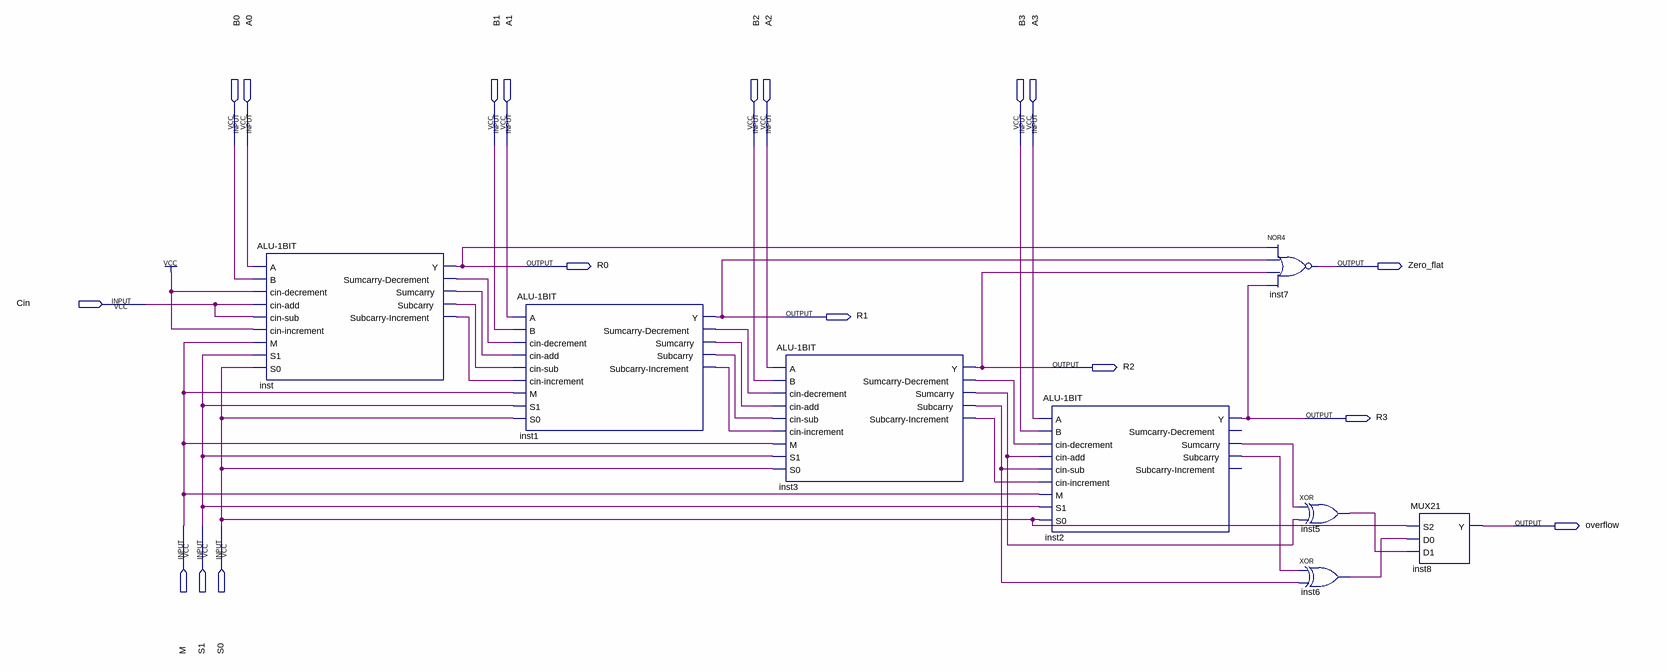
[diagram p0: schematic sheet]
// Quartus schematic ALU-8BIT.bdf as structural Verilog: 8 symbols, 18 pins
module \ALU-8BIT  (
  input  B0,
  input  A0,
  input  B1,
  input  A1,
  input  B2,
  input  A2,
  input  B3,
  input  A3,
  input  Cin,
  input  M,
  input  S1,
  input  S0,
  output R0,
  output Zero_flat,
  output R1,
  output R2,
  output R3,
  output overflow
);

  wire inst1_subcarry, inst1_subcarry_increment, inst1_sumcarry, inst1_sumcarry_decrement, inst2_subcarry,
       inst2_sumcarry, inst3_subcarry, inst3_subcarry_increment, inst3_sumcarry, inst3_sumcarry_decrement,
       inst5_out, inst6_out, inst_subcarry, inst_subcarry_increment, inst_sumcarry, inst_sumcarry_decrement;

  \ALU-1BIT  inst (
    .A(A0), .B(B0), .\cin-decrement (1'b1), .\cin-add (Cin), .\cin-sub (Cin), .\cin-increment (1'b1), .M(M),
    .S1(S1), .S0(S0), .Y(R0), .\Sumcarry-Decrement (inst_sumcarry_decrement), .Sumcarry(inst_sumcarry),
    .Subcarry(inst_subcarry), .\Subcarry-Increment (inst_subcarry_increment));
  \ALU-1BIT  inst1 (
    .A(A1), .B(B1), .\cin-decrement (inst_sumcarry_decrement), .\cin-add (inst_sumcarry),
    .\cin-sub (inst_subcarry), .\cin-increment (inst_subcarry_increment), .M(M), .S1(S1), .S0(S0), .Y(R1),
    .\Sumcarry-Decrement (inst1_sumcarry_decrement), .Sumcarry(inst1_sumcarry), .Subcarry(inst1_subcarry),
    .\Subcarry-Increment (inst1_subcarry_increment));
  \ALU-1BIT  inst3 (
    .A(A2), .B(B2), .\cin-decrement (inst1_sumcarry_decrement), .\cin-add (inst1_sumcarry),
    .\cin-sub (inst1_subcarry), .\cin-increment (inst1_subcarry_increment), .M(M), .S1(S1), .S0(S0), .Y(R2),
    .\Sumcarry-Decrement (inst3_sumcarry_decrement), .Sumcarry(inst3_sumcarry), .Subcarry(inst3_subcarry),
    .\Subcarry-Increment (inst3_subcarry_increment));
  \ALU-1BIT  inst2 (
    .A(A3), .B(B3), .\cin-decrement (inst3_sumcarry_decrement), .\cin-add (inst3_sumcarry),
    .\cin-sub (inst3_subcarry), .\cin-increment (inst3_subcarry_increment), .M(M), .S1(S1), .S0(S0), .Y(R3),
    .Sumcarry(inst2_sumcarry), .Subcarry(inst2_subcarry));  // open: Sumcarry-Decrement, Subcarry-Increment
  nor inst7 (Zero_flat, R0, R1, R2, R3);
  xor inst5 (inst5_out, inst2_sumcarry, inst3_sumcarry);
  xor inst6 (inst6_out, inst2_subcarry, inst3_subcarry);
  MUX21 inst8 (.S2(S0), .D0(inst6_out), .D1(inst5_out), .Y(overflow));
endmodule
